# Altium schematic sheet [000] Block Diagram.SchDoc
size A4
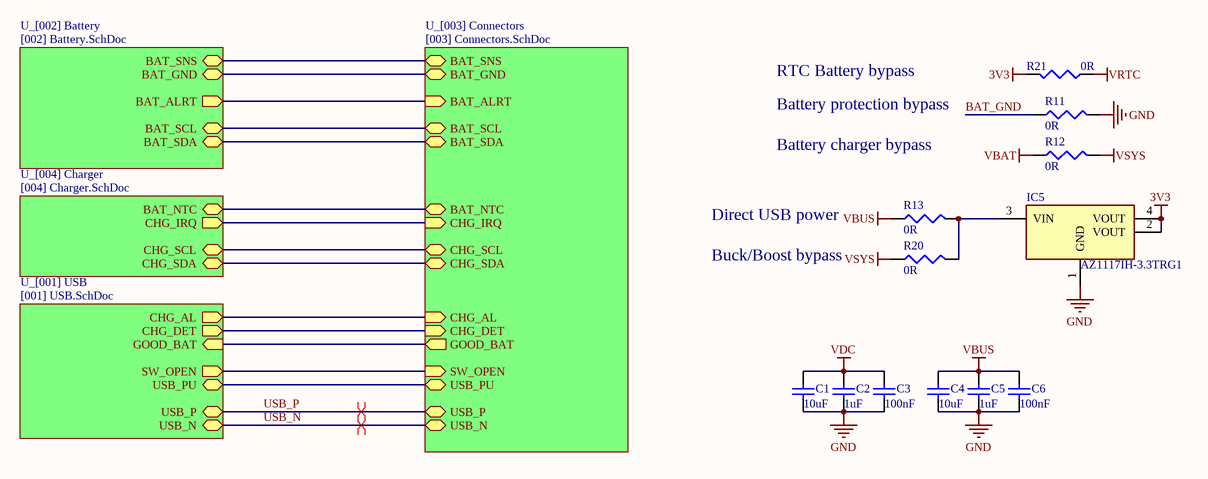
[diagram p0: [000] Block Diagram.SchDoc]

## Parts
C1  value 10uF  [1608[0603]]  (hidden comment: Cap Semi)
C2  value 1uF  [1608[0603]]  (hidden comment: Cap Semi)
C3  value 100nF  [1608[0603]]  (hidden comment: Cap Semi)
C4  value 10uF  [1608[0603]]  (hidden comment: Cap Semi)
C5  value 1uF  [1608[0603]]  (hidden comment: Cap Semi)
C6  value 100nF  [1608[0603]]  (hidden comment: Cap Semi)
IC5  AZ1117IH-3.3TRG1  [SOT230P700X170-4N]
R11  value 0R  [J1-0603]  (hidden comment: Res3)
R12  value 0R  [J1-0603]  (hidden comment: Res3)
R13  value 0R  [J1-0603]  (hidden comment: Res3)
R20  value 0R  [J1-0603]  (hidden comment: Res3)
R21  value 0R  [J1-0603]  (hidden comment: Res3)

## Sub-sheets
U_[001] USB = [001] USB.SchDoc: USB_N (bidir), USB_P (bidir), USB_PU (bidir), GOOD_BAT (in), SW_OPEN (out), CHG_AL (out), CHG_DET (out)
U_[002] Battery = [002] Battery.SchDoc: BAT_ALRT (out), BAT_SDA (bidir), BAT_SCL (bidir), BAT_GND (bidir), BAT_SNS (bidir)
U_[003] Connectors = [003] Connectors.SchDoc: BAT_SNS (bidir), BAT_GND (bidir), BAT_NTC (bidir), CHG_IRQ (in), BAT_ALRT (in), CHG_SCL (bidir), CHG_SDA (bidir), BAT_SCL (bidir), BAT_SDA (bidir), CHG_AL (in), CHG_DET (in), GOOD_BAT (out), SW_OPEN (in), USB_PU (bidir), USB_P (bidir), USB_N (bidir)
U_[004] Charger = [004] Charger.SchDoc: CHG_IRQ (out), CHG_SDA (bidir), CHG_SCL (bidir), BAT_NTC (bidir)

## Nets
3V3: IC5.2(VOUT) IC5.4(VOUT) R21.2
GND: C1.1 C2.1 C3.1 C4.1 C5.1 C6.1 IC5.1(GND) R11.2
VBAT: R12.1
VBUS: C4.2 C5.2 C6.2 R13.1
VDC: C1.2 C2.2 C3.2
VRTC: R21.1
VSYS: R12.2 R20.1
BAT_GND: R11.1
USB_N: sheet U_[001] USB/USB_N, sheet U_[003] Connectors/USB_N
USB_P: sheet U_[001] USB/USB_P, sheet U_[003] Connectors/USB_P
NetIC5_3: IC5.3(VIN) R13.2 R20.2
(unnamed): sheet U_[004] Charger/CHG_IRQ, sheet U_[003] Connectors/CHG_IRQ
(unnamed): sheet U_[004] Charger/CHG_SDA, sheet U_[003] Connectors/CHG_SDA
(unnamed): sheet U_[004] Charger/CHG_SCL, sheet U_[003] Connectors/CHG_SCL
(unnamed): sheet U_[004] Charger/BAT_NTC, sheet U_[003] Connectors/BAT_NTC
(unnamed): sheet U_[001] USB/USB_PU, sheet U_[003] Connectors/USB_PU
(unnamed): sheet U_[001] USB/GOOD_BAT, sheet U_[003] Connectors/GOOD_BAT
(unnamed): sheet U_[001] USB/SW_OPEN, sheet U_[003] Connectors/SW_OPEN
(unnamed): sheet U_[001] USB/CHG_AL, sheet U_[003] Connectors/CHG_AL
(unnamed): sheet U_[001] USB/CHG_DET, sheet U_[003] Connectors/CHG_DET
(unnamed): sheet U_[002] Battery/BAT_ALRT, sheet U_[003] Connectors/BAT_ALRT
(unnamed): sheet U_[002] Battery/BAT_SDA, sheet U_[003] Connectors/BAT_SDA
(unnamed): sheet U_[002] Battery/BAT_SCL, sheet U_[003] Connectors/BAT_SCL
(unnamed): sheet U_[002] Battery/BAT_GND, sheet U_[003] Connectors/BAT_GND
(unnamed): sheet U_[002] Battery/BAT_SNS, sheet U_[003] Connectors/BAT_SNS

## Layout directives
differential pair: USB_N, USB_P

## Notes on the sheet
- RTC Battery bypass
- Battery protection bypass
- Battery charger bypass
- Direct USB power
- Buck/Boost bypass

## Library data of the parts
C1-C6 = Cap Semi: Capacitor (Semiconductor SIM Model); Published: 8-Jun-2000; LatestRevisionDate: 29-May-2009; LatestRevisionNote: IPC-7351 Footprint Added.; PackageReference: C1206; Publisher: Altium Limited; PackageDescription: Chip Capacitor
IC5 = AZ1117IH-3.3TRG1: Integrated Circuit; Manufacturer_Name: Diodes Inc.; Datasheet Link: https://componentsearchengine.com/Datasheets/1/AZ1117IH-3.3TRG1.pdf; Height: 1.7mm; Mouser2 Part Number: 621-AZ1117IH-3.3TRG1; Mouser2 Price/Stock: https://www.mouser.com/Search/Refine.aspx?Keyword=621-AZ1117IH-3.3TRG1; Manufacturer_Part_Number: AZ1117IH-3.3TRG1
R11-R13 R20 R21 = Res3: Resistor; Published: 8-Jun-2000; LatestRevisionDate: 29-May-2009; LatestRevisionNote: IPC-7351 Footprint Added.; PackageReference: J1-0603; Publisher: Altium Limited; PackageDescription: Chip Resistor